# Altium schematic sheet 控制器最终图-论文用.SchDoc
size A2
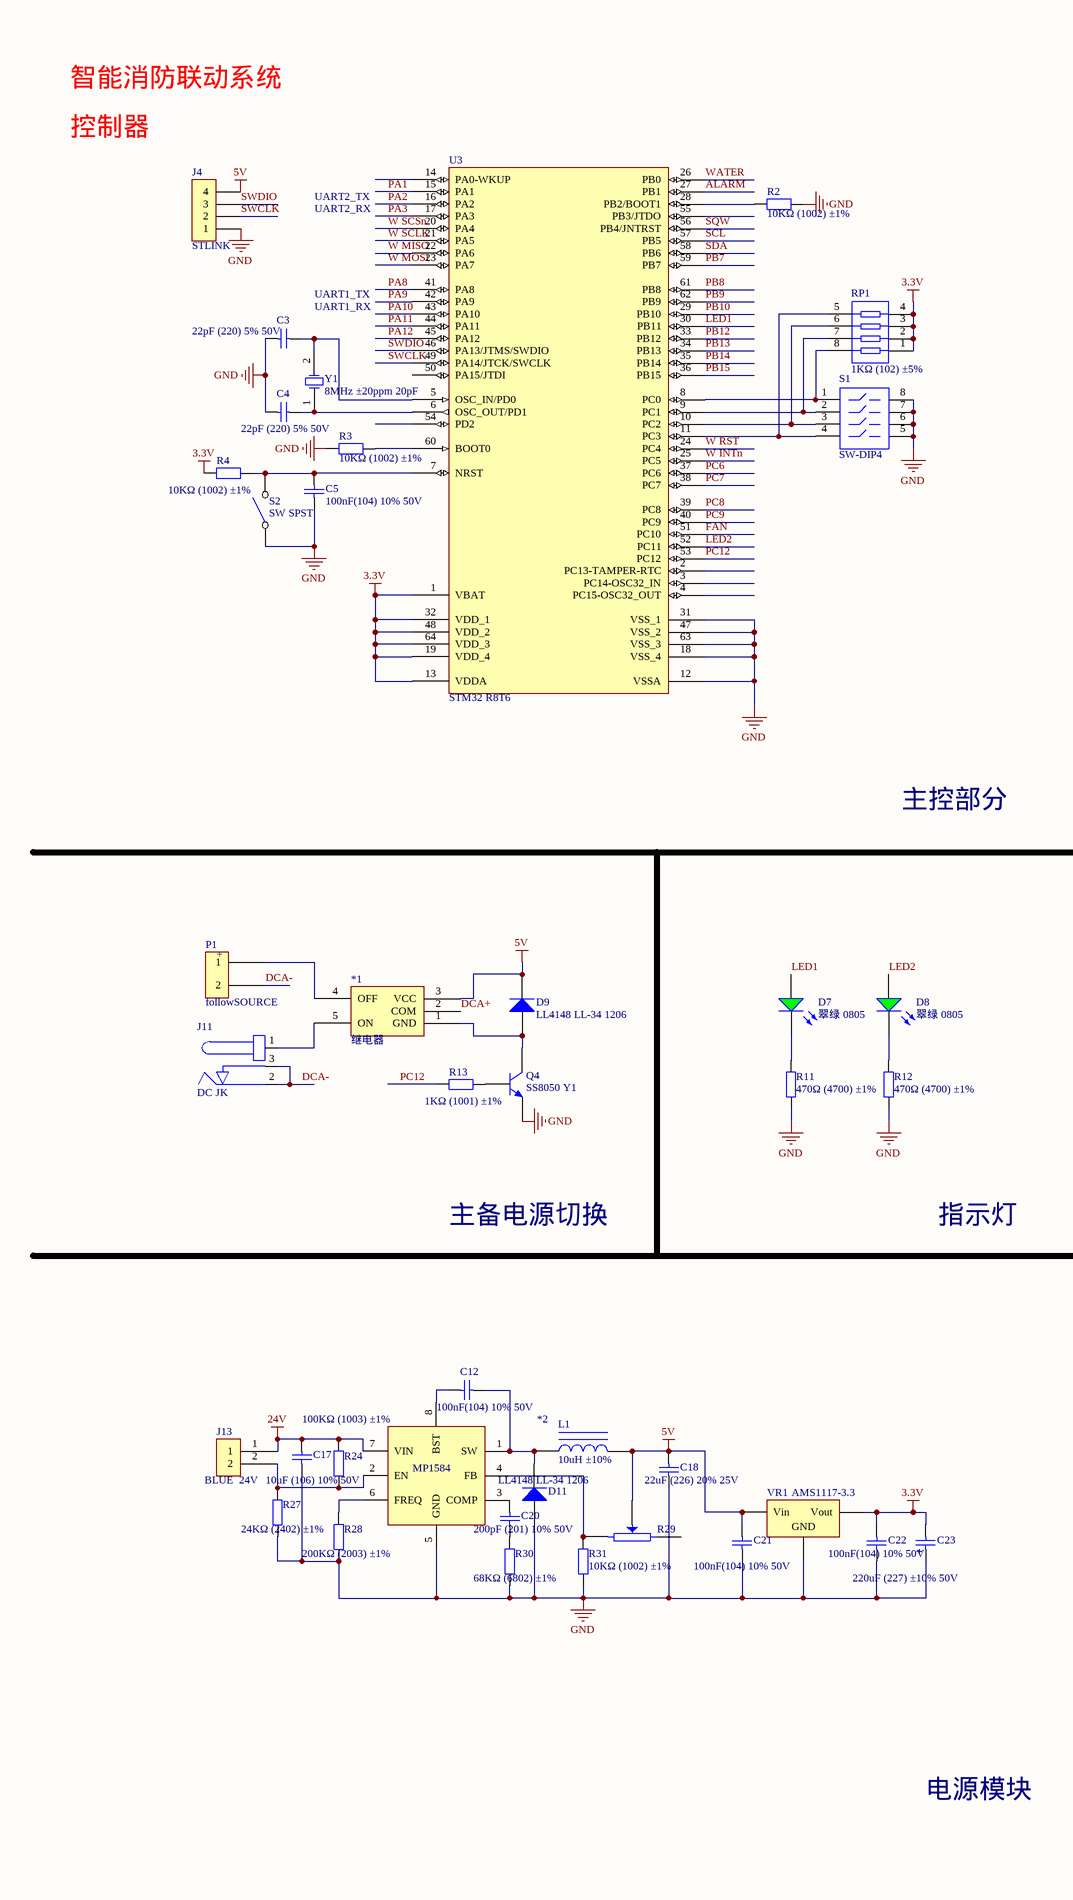
[diagram p0: 控制器最终图-论文用.SchDoc, left]
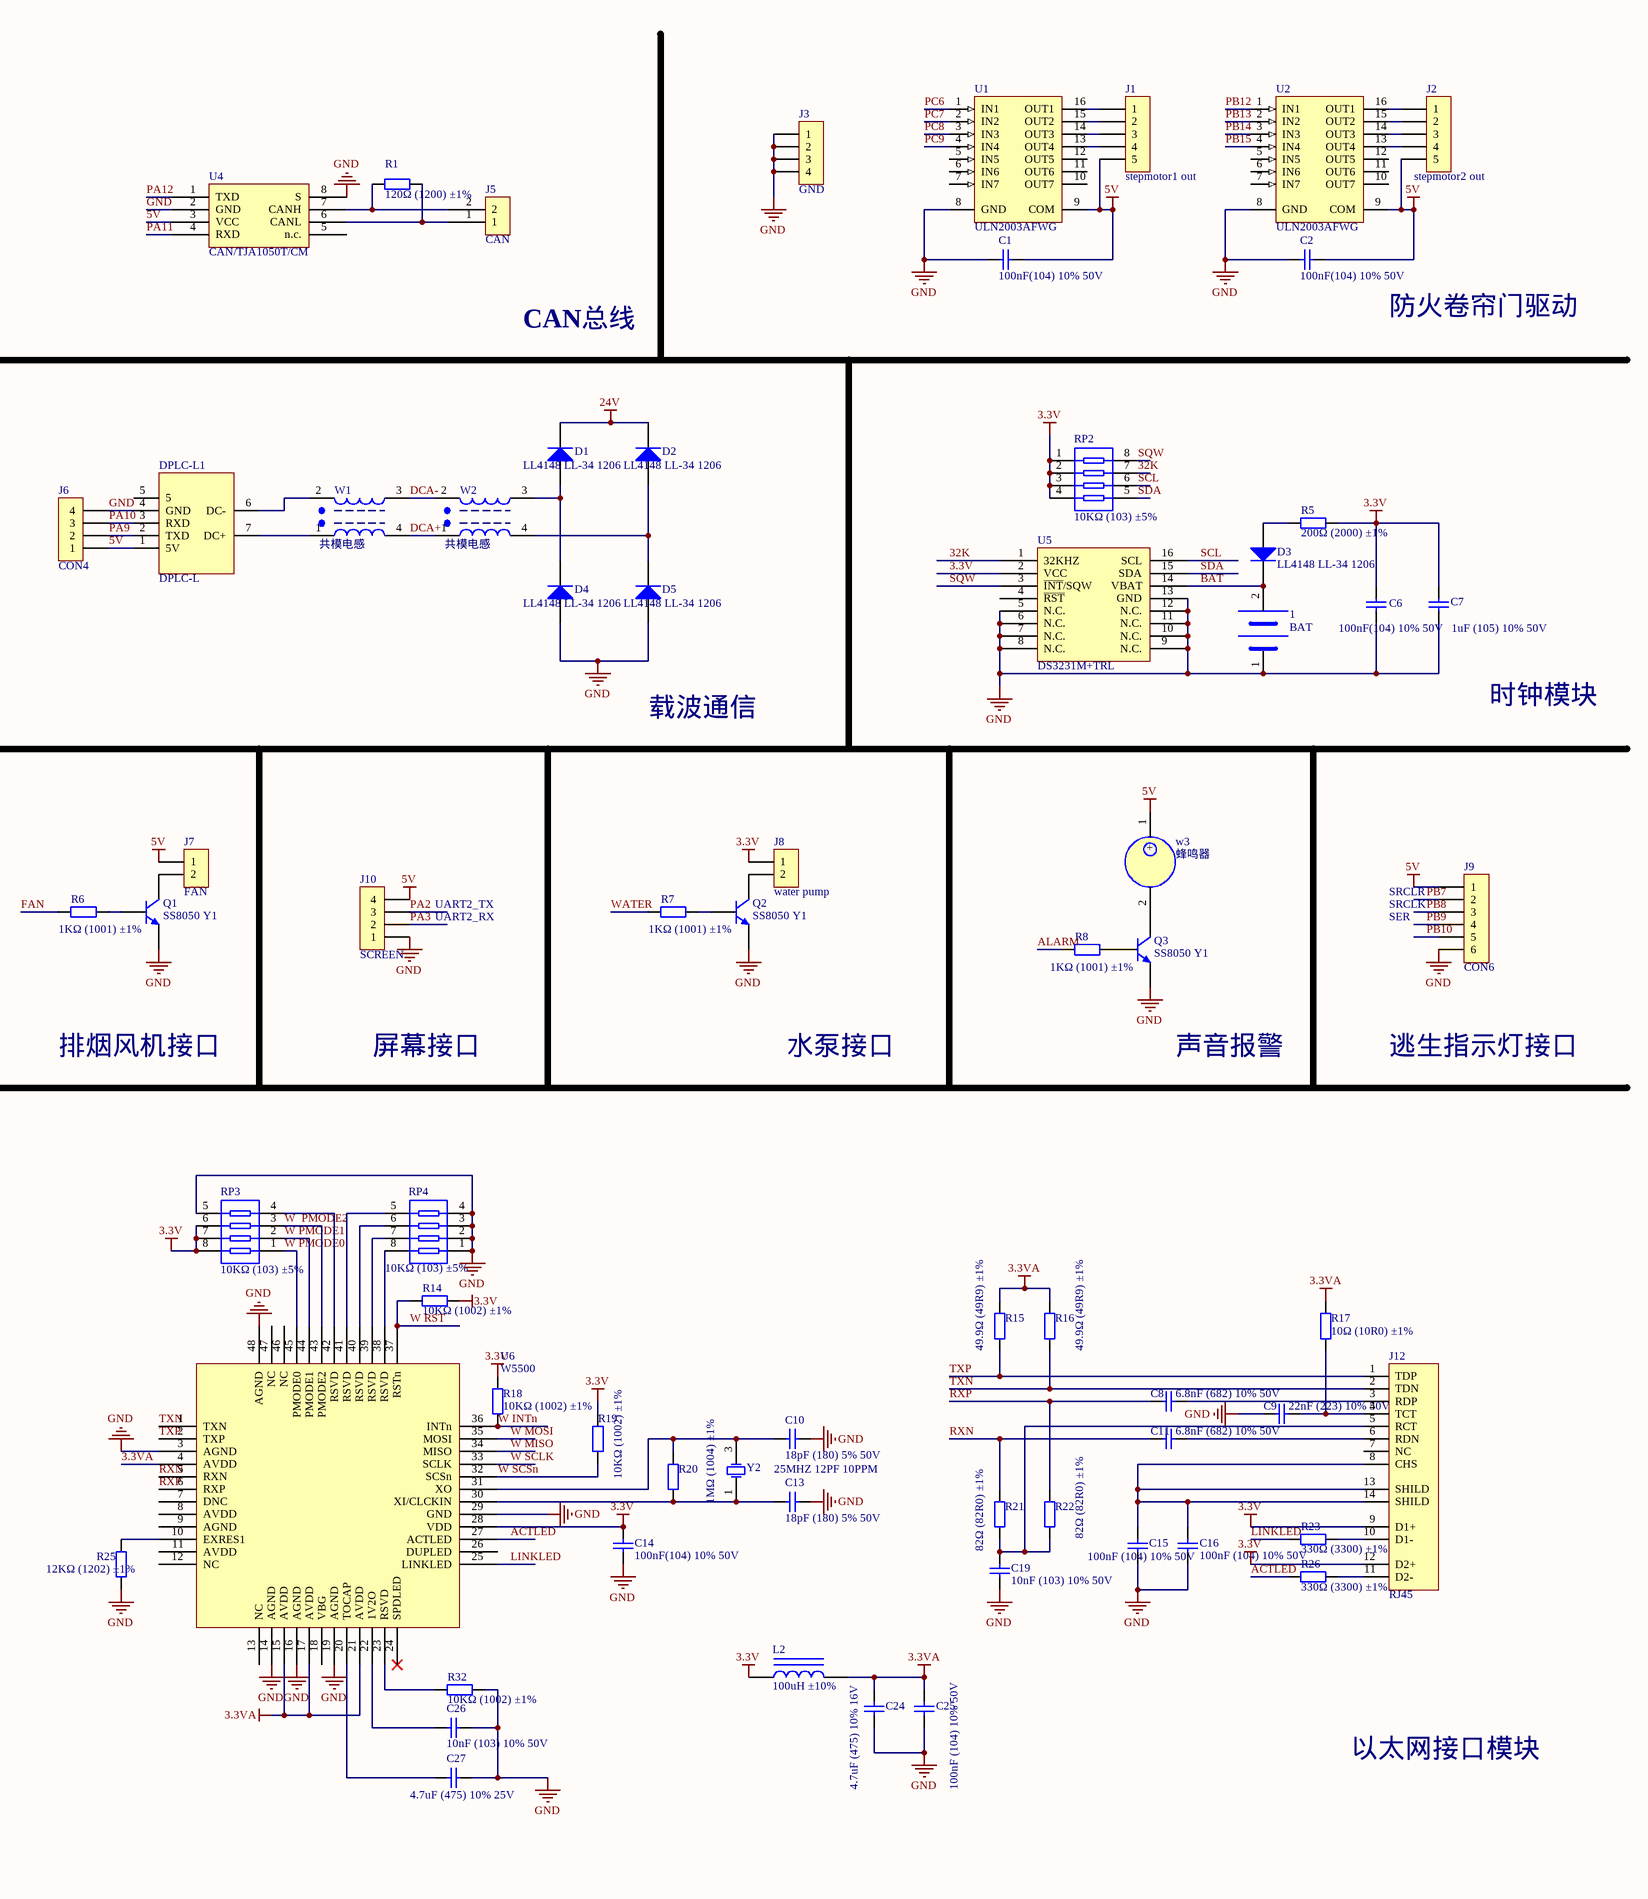
[diagram p1: 控制器最终图-论文用.SchDoc, right]

## Parts
1  BAT  [BAT]
*1  继电器  [RLY-964]
*2  MP1584
C1  100nF(104) 10% 50V  [LC-0805_C]
C2  100nF(104) 10% 50V  [LC-0805_C]
C3  22pF (220) 5% 50V  [LC-0805_C]
C4  22pF (220) 5% 50V  [LC-0805_C]
C5  100nF(104) 10% 50V  [LC-0805_C]
C6  100nF(104) 10% 50V  [LC-0805_C]
C7  1uF (105) 10% 50V  [LC-0805_C]
C8  6.8nF (682) 10% 50V  [LC-0603_C]
C9  22nF (223) 10% 50V  [LC-0603_C]
C10  18pF (180) 5% 50V  [LC-0805_C]
C11  6.8nF (682) 10% 50V  [LC-0603_C]
C12  100nF(104) 10% 50V  [LC-0805_C]
C13  18pF (180) 5% 50V  [LC-0805_C]
C14  100nF(104) 10% 50V  [LC-0805_C]
C15  100nF (104) 10% 50V  [LC-0603_C]
C16  100nF (104) 10% 50V  [LC-0603_C]
C17  10uF (106) 10% 50V  [LC-1206_C]
C18  22uF (226) 20% 25V  [LC-0805_C]
C19  10nF (103) 10% 50V  [LC-0603_C]
C20  200pF (201) 10% 50V  [LC-0805_C]
C21  100nF(104) 10% 50V  [LC-0805_C]
C22  100nF(104) 10% 50V  [LC-0805_C]
C23  220uF (227) ±10% 50V  [LC-CASE-B_3528]
C24  4.7uF (475) 10% 16V  [LC-0603_C]
C25  100nF (104) 10% 50V  [LC-0603_C]
C26  10nF (103) 10% 50V  [LC-0805_C]
C27  4.7uF (475) 10% 25V  [LC-0805_C]
D1  LL4148 LL-34 1206  [LC-LL-34]
D2  LL4148 LL-34 1206  [LC-LL-34]
D3  LL4148 LL-34 1206  [LC-LL-34]
D4  LL4148 LL-34 1206  [LC-LL-34]
D5  LL4148 LL-34 1206  [LC-LL-34]
D7  翠绿 0805  [LC-0805_LED_S1]
D8  翠绿 0805  [LC-0805_LED_S1]
D9  LL4148 LL-34 1206  [LC-LL-34]
D11  LL4148 LL-34 1206  [LC-LL-34]
DPLC-L1  DPLC-L  [DPLC-L]
J1  stepmotor1 out  [防反插乘5]
J2  stepmotor2 out  [防反插乘5]
J3  GND  [SIP4]
J4  STLINK  [SIP4]
J5  CAN  [蓝端子]
J6  CON4  [SIP4]
J7  FAN  [SIP2]
J8  water pump  [SIP2]
J9  CON6  [SIP6]
J10  SCREEN  [SIP4]
J11  DC JK  [DC]
J12  RJ45  [RJ-45_GBE]
J13  BLUE  24V  [蓝端子]
L1  10uH ±10%  [LC-0805_L]
L2  100uH ±10%  [LC-0805_L]
P1  followSOURCE  [蓝端子]
Q1  SS8050 Y1  [LC-SOT-23(SOT-23-3)]
Q2  SS8050 Y1  [LC-SOT-23(SOT-23-3)]
Q3  SS8050 Y1  [LC-SOT-23(SOT-23-3)]
Q4  SS8050 Y1  [LC-SOT-23(SOT-23-3)]
R1  120Ω (1200) ±1%  [LC-0805_R]
R2  10KΩ (1002) ±1%  [LC-0805_R]
R3  10KΩ (1002) ±1%  [LC-0805_R]
R4  10KΩ (1002) ±1%  [LC-0805_R]
R5  200Ω (2000) ±1%  [LC-0805_R]
R6  1KΩ (1001) ±1%  [LC-0805_R]
R7  1KΩ (1001) ±1%  [LC-0805_R]
R8  1KΩ (1001) ±1%  [LC-0805_R]
R11  470Ω (4700) ±1%  [LC-0805_R]
R12  470Ω (4700) ±1%  [LC-0805_R]
R13  1KΩ (1001) ±1%  [LC-0805_R]
R14  10KΩ (1002) ±1%  [LC-0805_R]
R15  49.9Ω (49R9) ±1%  [LC-0603_R]
R16  49.9Ω (49R9) ±1%  [LC-0603_R]
R17  10Ω (10R0) ±1%  [LC-0805_R]
R18  10KΩ (1002) ±1%  [LC-0805_R]
R19  10KΩ (1002) ±1%  [LC-0805_R]
R20  1MΩ (1004) ±1%  [LC-0805_R]
R21  82Ω (82R0) ±1%  [LC-0603_R]
R22  82Ω (82R0) ±1%  [LC-0603_R]
R23  330Ω (3300) ±1%  [LC-0603_R]
R24  100KΩ (1003) ±1%  [LC-0805_R]
R25  12KΩ (1202) ±1%  [LC-0805_R]
R26  330Ω (3300) ±1%  [LC-0603_R]
R27  24KΩ (2402) ±1%  [LC-0805_R]
R28  200KΩ (2003) ±1%  [LC-0805_R]
R29  2  (value not drawn)
R30  68KΩ (6802) ±1%  [LC-0805_R]
R31  10KΩ (1002) ±1%  [LC-0805_R]
R32  10KΩ (1002) ±1%  [LC-0805_R]
RP1  1KΩ (102) ±5%  [LC-0603_Rx4]
RP2  10KΩ (103) ±5%  [LC-0603_Rx4]
RP3  10KΩ (103) ±5%  [LC-0603_Rx4]
RP4  10KΩ (103) ±5%  [LC-0603_Rx4]
S1  SW-DIP4  [4位拨码开关]
S2  SW SPST  [单片机小按键]
U1  ULN2003AFWG  [LC-SOIC-16_150mil]
U2  ULN2003AFWG  [LC-SOIC-16_150mil]
U3  STM32 R8T6  [LC-LQFP-64_10x10x05P]
U4  CAN/TJA1050T/CM  [LC-SOIC-8_150mil]
U5  DS3231M+TRL  [LC-SOIC-16_300mil]
U6  W5500  [LC-LQFP-48_7x7x05P]
VR1  AMS1117-3.3  [LC-SOT-223]
W1  共模电感  [共模电感]
W2  共模电感  [共模电感]
w3  蜂鸣器  [蜂鸣器]
Y1  8MHz ±20ppm 20pF  [LC-SMD-5032_2P]
Y2  25MHZ 12PF 10PPM  [LC-SMD-3225_4P]

## Nets
3.3V: C6.2 C7.2 C14.2 C22.1 C23.2 J8.1 J12.9(D1+) J12.12(D2+) L2.1 R4.1 R5.1 R14.2 R18.2 R19.2 RP1.1 RP1.2 RP1.3 RP1.4 RP2.1 RP2.2 RP2.3 RP2.4 RP3.6 RP3.7 RP3.8 U3.1(VBAT) U3.13(VDDA) U3.19(VDD_4) U3.32(VDD_1) U3.48(VDD_2) U3.64(VDD_3) U5.2(VCC) U6.28(VDD) VR1.2(Vout)
3.3VA: C24.2 C25.2 L2.2 R15.2 R16.2 R17.2 U6.4(AVDD) U6.15(AVDD) U6.17(AVDD) U6.21(AVDD)
5V: *1.3(VCC) C1.2 C2.2 C18.2 C21.2 D9.2(K) DPLC-L1.1(5V) J1.5 J2.5 J4.4 J6.1 J7.1 J9.1 J10.4 L1.2 R29.3(W) U1.9(COM) U2.9(COM) U4.3(VCC) VR1.3(Vin) w3.1(+)
24V: *2.7(VIN) C17.2 D1.2(K) D2.2(K) J13.1 R24.2
GND: 1.1 *2.5(GND) C1.1 C2.1 C3.1 C4.1 C5.1 C6.1 C7.1 C9.1 C10.2 C13.2 C14.1 C15.1 C16.1 C17.1 C18.1 C19.1 C21.1 C22.2 C23.1 C24.1 C25.1 C26.2 C27.2 D4.1(A) D5.1(A) D11.1(A) DPLC-L1.4(GND) J3.1 J3.2 J3.3 J3.4 J4.1 J6.4 J9.6 J10.1 Q1.2(E) Q2.2(E) Q3.2(E) Q4.2(E) R2.2 R3.1 R11.1 R12.1 R25.1 R27.1 R28.1 R30.1 R31.1 R32.2 RP3.5 RP4.1 RP4.2 RP4.3 RP4.4 S1.5 S1.6 S1.7 S1.8 S2.1(COMMON) U1.8(GND) U2.8(GND) U3.12(VSSA) U3.18(VSS_4) U3.31(VSS_1) U3.47(VSS_2) U3.63(VSS_3) U4.2(GND) U4.8(S) U5.5(N.C.) U5.6(N.C.) U5.7(N.C.) U5.8(N.C.) U5.9(N.C.) U5.10(N.C.) U5.11(N.C.) U5.12(N.C.) U5.13(GND) U6.3(AGND) U6.14(AGND) U6.16(AGND) U6.19(AGND) U6.29(GND) U6.48(AGND) VR1.1(GND)
32K: RP2.7 U5.1(32KHZ)
ACTLED: R26.1 U6.27(ACTLED)
ALARM: R8.1 U3.27(PB1)
BAT: 1.2 D3.2(K) U5.14(VBAT)
DCA+: *1.2(COM) W1.4 W2.1
DCA-: J11.2(GND) J11.3(GND) P1.2 W1.3 W2.2
FAN: R6.1 U3.51(PC10)
LED1: D7.A U3.30(PB11)
LED2: D8.A U3.52(PC11)
LINKLED: R23.1 U6.25(LINKLED)
PA1: U3.15(PA1)
PA2: J10.3 U3.16(PA2)
PA3: J10.2 U3.17(PA3)
PA8: U3.41(PA8)
PA9: DPLC-L1.2(TXD) J6.2 U3.42(PA9)
PA10: DPLC-L1.3(RXD) J6.3 U3.43(PA10)
PA11: U3.44(PA11) U4.4(RXD)
PA12: U3.45(PA12) U4.1(TXD)
PB7: J9.2 U3.59(PB7)
PB8: J9.3 U3.61(PB8)
PB9: J9.4 U3.62(PB9)
PB10: J9.5 U3.29(PB10)
PB12: U2.1(IN1) U3.33(PB12)
PB13: U2.2(IN2) U3.34(PB13)
PB14: U2.3(IN3) U3.35(PB14)
PB15: U2.4(IN4) U3.36(PB15)
PC6: U1.1(IN1) U3.37(PC6)
PC7: U1.2(IN2) U3.38(PC7)
PC8: U1.3(IN3) U3.39(PC8)
PC9: U1.4(IN4) U3.40(PC9)
PC12: R13.1 U3.53(PC12)
RXN: C11.1 R21.2 U6.5(RXN)
RXP: C8.1 R22.2 U6.6(RXP)
SCL: RP2.6 U3.57(PB5) U5.16(SCL)
SDA: RP2.5 U3.58(PB6) U5.15(SDA)
SQW: RP2.8 U3.56(PB4/JNTRST) U5.3(~{INT}/SQW)
SWCLK: J4.2 U3.49(PA14/JTCK/SWCLK)
SWDIO: J4.3 U3.46(PA13/JTMS/SWDIO)
TXN: J12.2(TDN) R16.1 U6.1(TXN)
TXP: J12.1(TDP) R15.1 U6.2(TXP)
W  PMODE2: RP3.3 U6.43(PMODE2)
W INTn: R18.1 U3.25(PC5) U6.36(INTn)
W MISO: U3.22(PA6) U6.34(MISO)
W MOSI: U3.23(PA7) U6.35(MOSI)
W PMODE0: RP3.1 U6.45(PMODE0)
W PMODE1: RP3.2 U6.44(PMODE1)
W RST: R14.1 U3.24(PC4) U6.37(RSTn)
W SCLK: U3.21(PA5) U6.33(SCLK)
W SCSn: R19.1 U3.20(PA4) U6.32(SCSn)
WATER: R7.1 U3.26(PB0)
Net*1_1: *1.1(GND) D9.1(A) Q4.3(C)
Net*1_4: *1.4(OFF) P1.1
Net*1_5: *1.5(ON) J11.1(GND)
Net*2_1: *2.1(SW) C12.2 D11.2(K) L1.1
Net*2_2: *2.2(EN) J13.2 R24.1 R27.2
Net*2_3: *2.3(COMP) C20.2
Net*2_4: *2.4(FB) R29.1 R31.2
Net*2_6: *2.6(FREQ) R28.2
Net*2_8: *2.8(BST) C12.1
NetC3_2: C3.2 U3.5(OSC_IN/PD0) Y1.2(OSC2)
NetC4_2: C4.2 U3.6(OSC_OUT/PD1) Y1.1(OSC1)
NetC5_2: C5.2 R4.2 S2.2(NO) U3.7(NRST)
NetC8_2: C8.2 J12.3(RDP)
NetC9_2: C9.2 J12.4(TCT) R17.1
NetC10_1: C10.1 R20.2 U6.31(XO) Y2.3(OSC2)
NetC11_2: C11.2 J12.6(RDN)
NetC13_1: C13.1 R20.1 U6.30(XI/CLCKIN) Y2.1(OSC1)
NetC15_2: C15.2 C16.2 J12.8(CHS) J12.13(SHILD) J12.14(SHILD)
NetC19_2: C19.2 J12.5(RCT) R21.1 R22.1
NetC20_1: C20.1 R30.2
NetC26_1: C26.1 U6.22(1V2O)
NetC27_1: C27.1 U6.20(TOCAP)
NetD1_1: D1.1(A) D4.2(K) W2.3
NetD2_1: D2.1(A) D5.2(K) W2.4
NetD3_1: D3.1(A) R5.2
NetD7_K: D7.K R11.2
NetD8_K: D8.K R12.2
NetDPLC-L1_6: DPLC-L1.6(DC-) W1.2
NetDPLC-L1_7: DPLC-L1.7(DC+) W1.1
NetJ1_1: J1.1 U1.16(OUT1)
NetJ1_2: J1.2 U1.15(OUT2)
NetJ1_3: J1.3 U1.14(OUT3)
NetJ1_4: J1.4 U1.13(OUT4)
NetJ2_1: J2.1 U2.16(OUT1)
NetJ2_2: J2.2 U2.15(OUT2)
NetJ2_3: J2.3 U2.14(OUT3)
NetJ2_4: J2.4 U2.13(OUT4)
NetJ5_1: J5.1 R1.2 U4.6(CANL)
NetJ5_2: J5.2 R1.1 U4.7(CANH)
NetJ7_2: J7.2 Q1.3(C)
NetJ8_2: J8.2 Q2.3(C)
NetJ12_10: J12.10(D1-) R23.2
NetJ12_11: J12.11(D2-) R26.2
NetQ1_1: Q1.1(B) R6.2
NetQ2_1: Q2.1(B) R7.2
NetQ3_1: Q3.1(B) R8.2
NetQ3_3: Q3.3(C) w3.2
NetQ4_1: Q4.1(B) R13.2
NetR2_1: R2.1 U3.28(PB2/BOOT1)
NetR3_2: R3.2 U3.60(BOOT0)
NetR25_2: R25.2 U6.10(EXRES1)
NetR32_1: R32.1 U6.23(RSVD)
NetRP1_5: RP1.5 S1.4 U3.11(PC3)
NetRP1_6: RP1.6 S1.3 U3.10(PC2)
NetRP1_7: RP1.7 S1.2 U3.9(PC1)
NetRP1_8: RP1.8 S1.1 U3.8(PC0)
NetRP3_4: RP3.4 U6.42(RSVD)
NetRP4_5: RP4.5 U6.41(RSVD)
NetRP4_6: RP4.6 U6.40(RSVD)
NetRP4_7: RP4.7 U6.39(RSVD)
NetRP4_8: RP4.8 U6.38(RSVD)

Not connected (* = marked no-connect by the designer): DPLC-L1 5; J12 7(NC); R29 2; U1 5(IN5) 6(IN6) 7(IN7) 10(OUT7) 11(OUT6) 12(OUT5); U2 5(IN5) 6(IN6) 7(IN7) 10(OUT7) 11(OUT6) 12(OUT5); U3 2(PC13-TAMPER-RTC) 3(PC14-OSC32_IN) 4(PC15-OSC32_OUT) 14(PA0-WKUP) 50(PA15/JTDI) 54(PD2) 55(PB3/JTDO); U4 5(n.c.); U5 4(~{RST}); U6 7(DNC) 8(AVDD) 9(AGND) 11(AVDD) 12(NC) 13(NC) 18(VBG) 24(SPDLED)* 26(DUPLED) 46(NC) 47(NC)

## Notes on the sheet
- 智能消防联动系统
- 控制器
- UART2_TX
- UART2_RX
- (near C3) UART1_TX
- (near C3) UART1_RX
- CAN总线
- 防火卷帘门驱动
- 载波通信
- 时钟模块
- 主控部分
- (near J9) SRCLR
- (near J9) SRCLK
- SER
- (near P1) +
- 排烟风机接口
- 屏幕接口
- 水泵接口
- 声音报警
- 逃生指示灯接口
- 主备电源切换
- 指示灯
- 以太网接口模块
- 电源模块

## Library data of the parts
C1 C2 C5 C6 C12 C14 C21 C22 = 0805 100nF(104) 10% 50V: 贴片电容; ComponentLink1Description: 供应商链接; ComponentLink1URL: http://www.szlcsc.com/product/details_50686.html; Package: 0805; Supplier: LC; SuppliersPartNumber: C49678
C3 C4 = 0805 22pF (220) 5% 50V: 贴片电容; ComponentLink1Description: 供应商链接; ComponentLink1URL: http://www.szlcsc.com/product/details_2156.html; Package: 0805; Supplier: LC; SuppliersPartNumber: C1804
C7 = 0805 1uF (105) 10% 50V: 贴片电容; ComponentLink1Description: 供应商链接; ComponentLink1URL: http://www.szlcsc.com/product/details_29074.html; Package: 0805; Supplier: LC; SuppliersPartNumber: C28323
C8 C11 = 0603 6.8nF (682) 10% 50V: 贴片电容; ComponentLink1Description: 供应商链接; ComponentLink1URL: http://www.szlcsc.com/product/details_1983.html; Package: 0603; Supplier: LC; SuppliersPartNumber: C1631
C9 = 0603 22nF (223) 10% 50V: 贴片电容; ComponentLink1Description: 供应商链接; ComponentLink1URL: http://www.szlcsc.com/product/details_21834.html; Package: 0603; Supplier: LC; SuppliersPartNumber: C21122
C10 C13 = 0805 18pF (180) 5% 50V: 贴片电容; ComponentLink1Description: 供应商链接; ComponentLink1URL: http://www.szlcsc.com/product/details_2149.html; Package: 0805; Supplier: LC; SuppliersPartNumber: C1797
C15 C16 C25 = 0603 100nF (104) 10% 50V: 贴片电容; ComponentLink1Description: 供应商链接; ComponentLink1URL: http://www.szlcsc.com/product/details_15331.html; Package: 0603; Supplier: LC; SuppliersPartNumber: C14663
C17 = 1206 10uF (106) 10% 50V: 贴片电容; ComponentLink1Description: 供应商链接; ComponentLink1URL: http://www.szlcsc.com/product/details_14236.html; Package: 1206; Supplier: LC; SuppliersPartNumber: C13585
C18 = 0805 22uF (226) 20% 25V: 贴片电容; ComponentLink1Description: 供应商链接; ComponentLink1URL: http://www.szlcsc.com/product/details_46786.html; Package: 0805; Supplier: LC; SuppliersPartNumber: C45783
C19 = 0603 10nF (103) 10% 50V: 贴片电容; ComponentLink1Description: 供应商链接; ComponentLink1URL: http://www.szlcsc.com/product/details_58143.html; Package: 0603; Supplier: LC; SuppliersPartNumber: C57112
C20 = 0805 200pF (201) 10% 50V: 贴片电容; ComponentLink1Description: 供应商链接; ComponentLink1URL: http://www.szlcsc.com/product/details_2076.html; Package: 0805; Supplier: LC; SuppliersPartNumber: C1724
C23 = 3528 100uF (107) 10% 6.3V: 钽电容; ComponentLink1Description: 供应商链接; ComponentLink1URL: http://www.szlcsc.com/product/details_16815.html; Package: 3528; Supplier: LC; SuppliersPartNumber: C16133
C24 = 0603 4.7uF (475) 10% 16V: 贴片电容; ComponentLink1Description: 供应商链接; ComponentLink1URL: http://www.szlcsc.com/product/details_20375.html; Package: 0603; Supplier: LC; SuppliersPartNumber: C19666
C26 = 0805 10nF (103) 10% 50V: 贴片电容; ComponentLink1Description: 供应商链接; ComponentLink1URL: http://www.szlcsc.com/product/details_2062.html; Package: 0805; Supplier: LC; SuppliersPartNumber: C1710
C27 = 0805 4.7uF (475) 10% 25V: 贴片电容; ComponentLink1Description: 供应商链接; ComponentLink1URL: http://www.szlcsc.com/product/details_2131.html; Package: 0805; Supplier: LC; SuppliersPartNumber: C1779
D1-D5 D9 D11 = LL-34 LL4148 LL-34 1206: 开关二极管; ComponentLink1Description: 供应商链接; ComponentLink1URL: http://www.szlcsc.com/product/details_10338.html; Package: LL-34; Supplier: LC; SuppliersPartNumber: C9808
D7 D8 = 0805 翠绿: 发光二极管; ComponentLink1Description: 供应商链接; ComponentLink1URL: http://www.szlcsc.com/product/details_2670.html; Package: 0805; Supplier: LC; SuppliersPartNumber: C2297
J1 J2 = CON5
J3 J4 J10 = CON4
J5 J13 P1 = 蓝端子
J7 J8 = CON2
L1 = 0805 10uH 10%: 贴片电感; ComponentLink1Description: 供应商链接; ComponentLink1URL: http://www.szlcsc.com/product/details_1398.html; Package: 0805; Supplier: LC; SuppliersPartNumber: C1046
L2 = 0805 100uH 10%: 贴片电感; ComponentLink1Description: 供应商链接; ComponentLink1URL: http://www.szlcsc.com/product/details_69137.html; Package: 0805; Supplier: LC; SuppliersPartNumber: C68035
Q1-Q4 = SOT-23 SS8050 Y1: 三极管; ComponentLink1Description: 供应商链接; ComponentLink1URL: http://www.szlcsc.com/product/details_2507.html; Package: SOT-23; Supplier: LC; SuppliersPartNumber: C2150
R1 = 0805 120Ω (1200) 1%: 贴片电阻; ComponentLink1Description: 供应商链接; ComponentLink1URL: http://www.szlcsc.com/product/details_18125.html; Package: 0805; Supplier: LC; SuppliersPartNumber: C17437
R2-R4 R14 R18 R19 R31 R32 = 0805 10KΩ (1002) 1%: 贴片电阻; ComponentLink1Description: 供应商链接; ComponentLink1URL: http://www.szlcsc.com/product/details_18102.html; Package: 0805; Supplier: LC; SuppliersPartNumber: C17414
R5 = 0805 200Ω (2000) 1%: 贴片电阻; ComponentLink1Description: 供应商链接; ComponentLink1URL: http://www.szlcsc.com/product/details_18228.html; Package: 0805; Supplier: LC; SuppliersPartNumber: C17540
R6-R8 R13 = 0805 1KΩ (1001) 1%: 贴片电阻; ComponentLink1Description: 供应商链接; ComponentLink1URL: http://www.szlcsc.com/product/details_18201.html; Package: 0805; Supplier: LC; SuppliersPartNumber: C17513
R11 R12 = 0805 470Ω (4700) 1%: 贴片电阻; ComponentLink1Description: 供应商链接; ComponentLink1URL: http://www.szlcsc.com/product/details_18398.html; Package: 0805; Supplier: LC; SuppliersPartNumber: C17710
R15 R16 = 0603 49.9Ω (49R9) 1%: 贴片电阻; ComponentLink1Description: 供应商链接; ComponentLink1URL: http://www.szlcsc.com/product/details_23912.html; Package: 0603; Supplier: LC; SuppliersPartNumber: C23185
R17 = 0805 10Ω (10R0) 1%: 贴片电阻; ComponentLink1Description: 供应商链接; ComponentLink1URL: http://www.szlcsc.com/product/details_18103.html; Package: 0805; Supplier: LC; SuppliersPartNumber: C17415
R20 = 0805 1MΩ (1004) 1%: 贴片电阻; ComponentLink1Description: 供应商链接; ComponentLink1URL: http://www.szlcsc.com/product/details_18202.html; Package: 0805; Supplier: LC; SuppliersPartNumber: C17514
R21 R22 = 0603 82Ω (82R0) 1%: 贴片电阻; ComponentLink1Description: 供应商链接; ComponentLink1URL: http://www.szlcsc.com/product/details_23982.html; Package: 0603; Supplier: LC; SuppliersPartNumber: C23255
R23 R26 = 0603 330Ω (3300) 1%: 贴片电阻; ComponentLink1Description: 供应商链接; ComponentLink1URL: http://www.szlcsc.com/product/details_23865.html; Package: 0603; Supplier: LC; SuppliersPartNumber: C23138
R24 = 0805 100KΩ (1003) 1%: 贴片电阻; ComponentLink1Description: 供应商链接; ComponentLink1URL: http://www.szlcsc.com/product/details_18095.html; Package: 0805; Supplier: LC; SuppliersPartNumber: C17407
R25 = 0805 12KΩ (1202) 1%: 贴片电阻; ComponentLink1Description: 供应商链接; ComponentLink1URL: http://www.szlcsc.com/product/details_18132.html; Package: 0805; Supplier: LC; SuppliersPartNumber: C17444
R27 = 0805 24KΩ (2402) 1%: 贴片电阻; ComponentLink1Description: 供应商链接; ComponentLink1URL: http://www.szlcsc.com/product/details_18263.html; Package: 0805; Supplier: LC; SuppliersPartNumber: C17575
R28 = 0805 200KΩ (2003) 1%: 贴片电阻; ComponentLink1Description: 供应商链接; ComponentLink1URL: http://www.szlcsc.com/product/details_18227.html; Package: 0805; Supplier: LC; SuppliersPartNumber: C17539
R29 = POT2: 滑变2
R30 = 0805 68KΩ (6802) 1%: 贴片电阻; ComponentLink1Description: 供应商链接; ComponentLink1URL: http://www.szlcsc.com/product/details_18489.html; Package: 0805; Supplier: LC; SuppliersPartNumber: C17801
RP1 = 0603*4  1KΩ (102) 5%: 贴片排阻; ComponentLink1Description: 供应商链接; ComponentLink1URL: http://www.szlcsc.com/product/details_20907.html; Package: 0603*4; Supplier: LC; SuppliersPartNumber: C20197
RP2-RP4 = 0603*4  10KΩ (103) 5%: 贴片排阻; ComponentLink1Description: 供应商链接; ComponentLink1URL: http://www.szlcsc.com/product/details_30472.html; Package: 0603*4; Supplier: LC; SuppliersPartNumber: C29718
S1 = SW-DIP4: 4位拨码开关
S2 = SW SPST: 单刀单掷开关
U1 U2 = ULN2003AFWG: 大电流驱动; ComponentLink1Description: 供应商链接; ComponentLink1URL: http://www.szlcsc.com/product/details_5880.html; Package: SOIC-16_150mil; Supplier: LC; SuppliersPartNumber: C5437
U4 = CAN/TJA1050T/CM: CAN; ComponentLink1Description: 供应商链接; ComponentLink1URL: http://www.szlcsc.com/product/details_7424.html; Package: SOIC-8_150mil; Supplier: LC; SuppliersPartNumber: C6952
U5 = DS3231M+TRL: 实时时钟; ComponentLink1Description: 供应商链接; ComponentLink1URL: http://www.szlcsc.com/product/details_38643.html; Package: SOIC-16_300mil; Supplier: LC; SuppliersPartNumber: C37663
U6 = W5500: 以太网; ComponentLink1Description: 供应商链接; ComponentLink1URL: http://www.szlcsc.com/product/details_33808.html; Package: LQFP-48_7x7x05P; Supplier: LC; SuppliersPartNumber: C32843
VR1 = SOT-223 AMS1117-3.3: 低压差线性稳压(LDO); ComponentLink1Description: 供应商链接; ComponentLink1URL: http://www.szlcsc.com/product/details_6652.html; Package: SOT-223; Supplier: LC; SuppliersPartNumber: C6186
Y1 = SMD-5032_2P 8MHz 20ppm 20pF: 贴片晶振; ComponentLink1Description: 供应商链接; ComponentLink1URL: http://www.szlcsc.com/product/details_19261.html; Package: SMD-5032_2P; Supplier: LC; SuppliersPartNumber: C18560
Y2 = SMD-3225_4P  25MHZ 12PF 10PPM: 贴片晶振; ComponentLink1Description: 供应商链接; ComponentLink1URL: http://www.szlcsc.com/product/details_9526.html; Package: SMD-3225_4P; Supplier: LC; SuppliersPartNumber: C9006